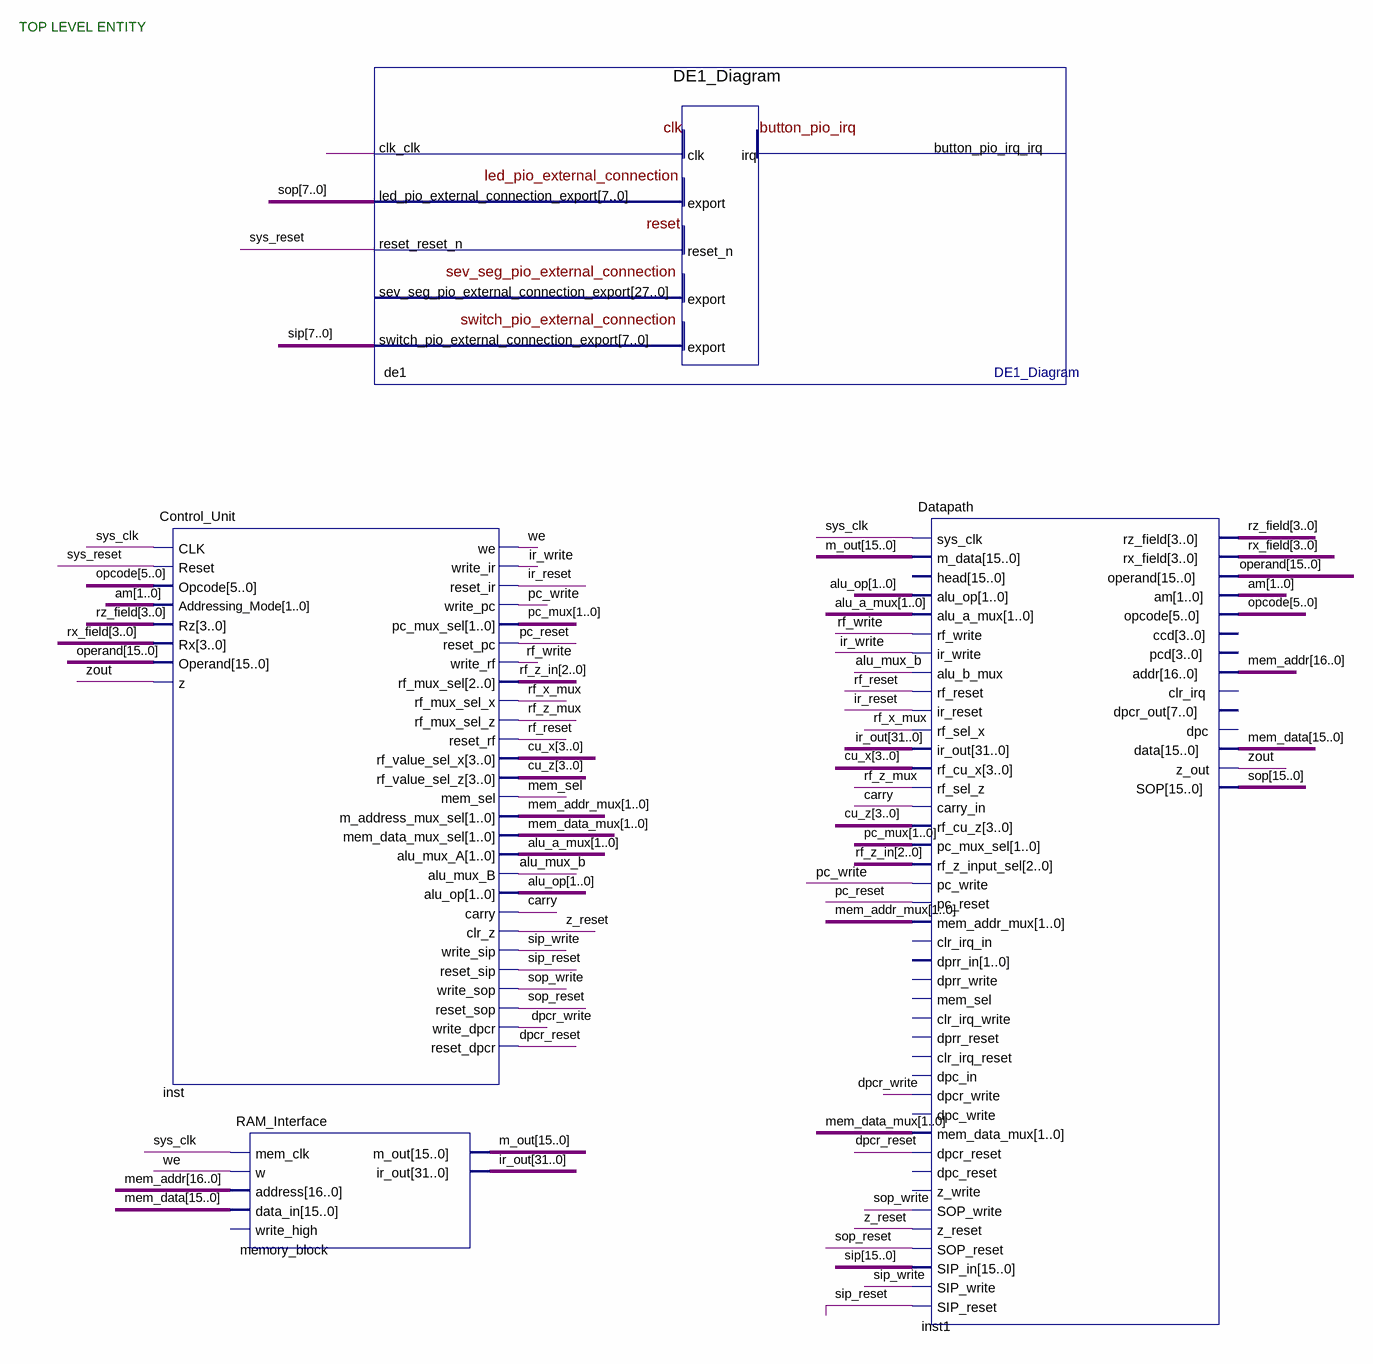
[diagram p0: schematic sheet]
// Quartus schematic ReCOP-Quartus.bdf as structural Verilog: 4 symbols, 0 pins
module \ReCOP-Quartus  (
);

  wire alu_mux_b, carry, dpcr_reset, dpcr_write, ir_reset, ir_write, mem_sel, pc_reset, pc_write, rf_reset,
       rf_write, rf_x_mux, rf_z_mux, sip_reset, sip_write, sop_reset, sop_write, sys_clk, sys_reset,
       undriven, we, z_reset, zout;
  wire [1:0] alu_a_mux, alu_op, am, mem_addr_mux, mem_data_mux, pc_mux;
  wire [2:0] rf_z_in;
  wire [3:0] cu_x, cu_z, rx_field, rz_field;
  wire [5:0] opcode;
  wire [15:0] m_out, mem_data, operand, sip, sop;
  wire [16:0] mem_addr;
  wire [31:0] ir_out;

  Control_Unit inst (
    .CLK(sys_clk), .Reset(sys_reset), .Opcode(opcode), .Addressing_Mode(am), .Rz(rz_field), .Rx(rx_field),
    .Operand(operand), .z(zout), .we(we), .write_ir(ir_write), .reset_ir(ir_reset), .write_pc(pc_write),
    .pc_mux_sel(pc_mux), .reset_pc(pc_reset), .write_rf(rf_write), .rf_mux_sel(rf_z_in),
    .rf_mux_sel_x(rf_x_mux), .rf_mux_sel_z(rf_z_mux), .reset_rf(rf_reset), .rf_value_sel_x(cu_x),
    .rf_value_sel_z(cu_z), .mem_sel(mem_sel), .m_address_mux_sel(mem_addr_mux),
    .mem_data_mux_sel(mem_data_mux), .alu_mux_A(alu_a_mux), .alu_mux_B(alu_mux_b), .alu_op(alu_op),
    .carry(carry), .clr_z(z_reset), .write_sip(sip_write), .reset_sip(sip_reset), .write_sop(sop_write),
    .reset_sop(sop_reset), .write_dpcr(dpcr_write), .reset_dpcr(dpcr_reset));
  RAM_Interface memory_block (
    .mem_clk(sys_clk), .w(we), .address(mem_addr), .data_in(mem_data), .m_out(m_out), .ir_out(ir_out));  // open: write_high
  DE1_Diagram de1 (
    .clk_clk(undriven), .reset_reset_n(sys_reset), .switch_pio_external_connection_export(sip[7:0]),
    .led_pio_external_connection_export(sop[7:0]));  // open: button_pio_irq_irq, sev_seg_pio_external_connection_export
  Datapath inst1 (
    .sys_clk(sys_clk), .m_data(m_out), .alu_op(alu_op), .alu_a_mux(alu_a_mux), .rf_write(rf_write),
    .ir_write(ir_write), .alu_b_mux(alu_mux_b), .rf_reset(rf_reset), .ir_reset(ir_reset),
    .rf_sel_x(rf_x_mux), .ir_out(ir_out), .rf_cu_x(cu_x), .rf_sel_z(rf_z_mux), .carry_in(carry),
    .rf_cu_z(cu_z), .pc_mux_sel(pc_mux), .rf_z_input_sel(rf_z_in), .pc_write(pc_write), .pc_reset(pc_reset),
    .mem_addr_mux(mem_addr_mux), .dpcr_write(dpcr_write), .mem_data_mux(mem_data_mux),
    .dpcr_reset(dpcr_reset), .SOP_write(sop_write), .z_reset(z_reset), .SOP_reset(sop_reset), .SIP_in(sip),
    .SIP_write(sip_write), .SIP_reset(sip_reset), .rz_field(rz_field), .rx_field(rx_field),
    .operand(operand), .am(am), .opcode(opcode), .addr(mem_addr), .data(mem_data), .z_out(zout), .SOP(sop));  // open: head, clr_irq_in, dprr_in, dprr_write, mem_sel, clr_irq_write, dprr_reset, clr_irq_reset, dpc_in, dpc_write, dpc_reset, z_write, ccd, pcd, clr_irq, dpcr_out, dpc

  // Notes on the sheet:
  //   TOP LEVEL ENTITY
endmodule
